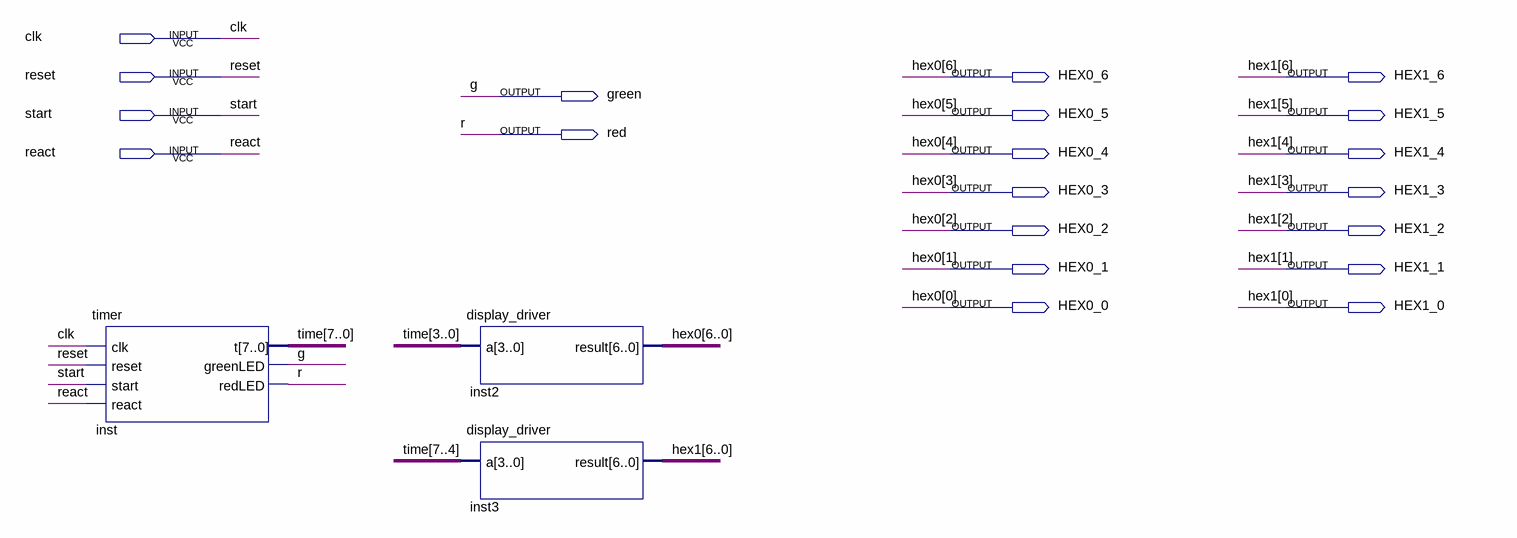
[diagram p0: schematic sheet]
// Quartus schematic react_circuit.bdf as structural Verilog: 3 symbols, 20 pins
module react_circuit (
  input  clk,
  input  reset,
  input  start,
  input  react,
  output HEX0_6,
  output HEX1_6,
  output green,
  output HEX0_5,
  output HEX1_5,
  output red,
  output HEX0_4,
  output HEX1_4,
  output HEX0_3,
  output HEX1_3,
  output HEX0_2,
  output HEX1_2,
  output HEX0_1,
  output HEX1_1,
  output HEX0_0,
  output HEX1_0
);

  wire [7:0] \time ;

  timer inst (.clk(clk), .reset(reset), .start(start), .react(react), .t(\time ), .greenLED(green), .redLED(red));
  display_driver inst2 (.a(\time [3:0]), .result({HEX0_6, HEX0_5, HEX0_4, HEX0_3, HEX0_2, HEX0_1, HEX0_0}));
  display_driver inst3 (.a(\time [7:4]), .result({HEX1_6, HEX1_5, HEX1_4, HEX1_3, HEX1_2, HEX1_1, HEX1_0}));

  // Other names for the same wires on the sheet: g = green;
  //   hex0[6:0] = {HEX0_6, HEX0_5, HEX0_4, HEX0_3, HEX0_2, HEX0_1, HEX0_0};
  //   hex1[6:0] = {HEX1_6, HEX1_5, HEX1_4, HEX1_3, HEX1_2, HEX1_1, HEX1_0}; r = red
endmodule
